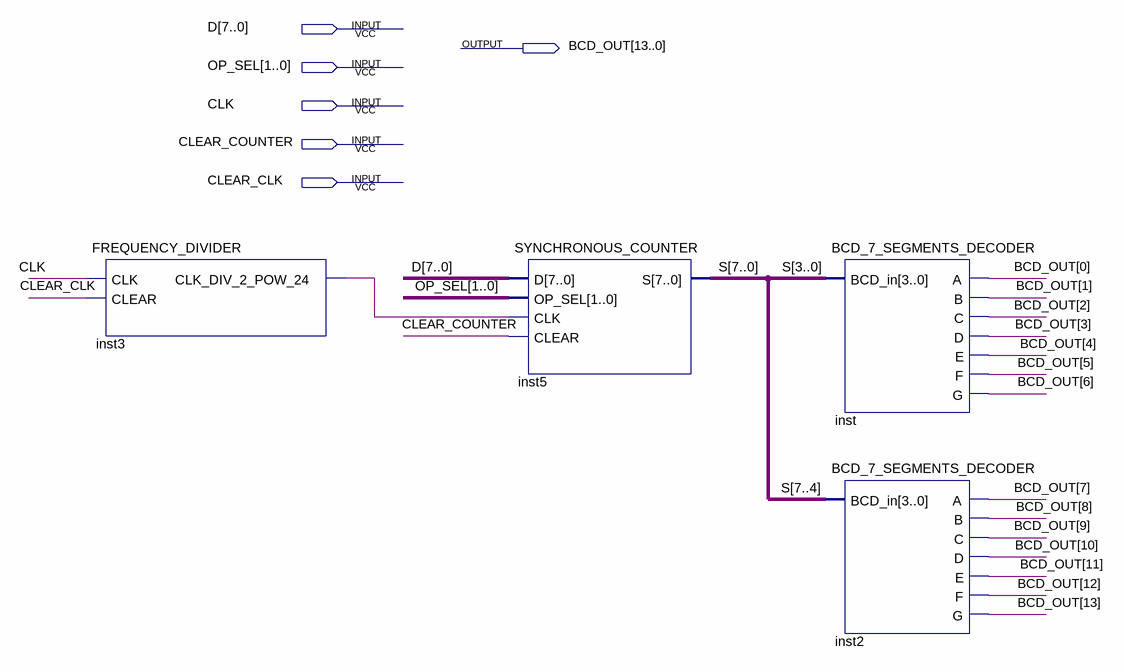
[diagram p0: schematic sheet]
// Quartus schematic SYNC_COUNTER_BCD.bdf as structural Verilog: 4 symbols, 6 pins
module SYNC_COUNTER_BCD (
  input  [7:0] D,
  input  [1:0] OP_SEL,
  input  CLK,
  input  CLEAR_COUNTER,
  input  CLEAR_CLK,
  output [13:0] BCD_OUT
);

  wire inst3_clk_div_2_pow_24;
  wire [7:0] S;

  FREQUENCY_DIVIDER inst3 (.CLK(CLK), .CLEAR(CLEAR_CLK), .CLK_DIV_2_POW_24(inst3_clk_div_2_pow_24));
  SYNCHRONOUS_COUNTER inst5 (.D(D), .OP_SEL(OP_SEL), .CLK(inst3_clk_div_2_pow_24), .CLEAR(CLEAR_COUNTER), .S(S));
  BCD_7_SEGMENTS_DECODER inst (
    .BCD_in(S[3:0]), .A(BCD_OUT[0]), .B(BCD_OUT[1]), .C(BCD_OUT[2]), .D(BCD_OUT[3]), .E(BCD_OUT[4]),
    .F(BCD_OUT[5]), .G(BCD_OUT[6]));
  BCD_7_SEGMENTS_DECODER inst2 (
    .BCD_in(S[7:4]), .A(BCD_OUT[7]), .B(BCD_OUT[8]), .C(BCD_OUT[9]), .D(BCD_OUT[10]), .E(BCD_OUT[11]),
    .F(BCD_OUT[12]), .G(BCD_OUT[13]));
endmodule
